# EasyEDA Pro project 最小系统板.eprj, schematic Schematic1
Board Name: Board1; Create Date: 2024-12-25; Page Name: P1; Project Name: 186改迪文屏-yan; Schematic Name: Schematic1; Update Date: 2025-02-26; Company: 嘉立创EDA; Page Size: A4; Version: V1.0
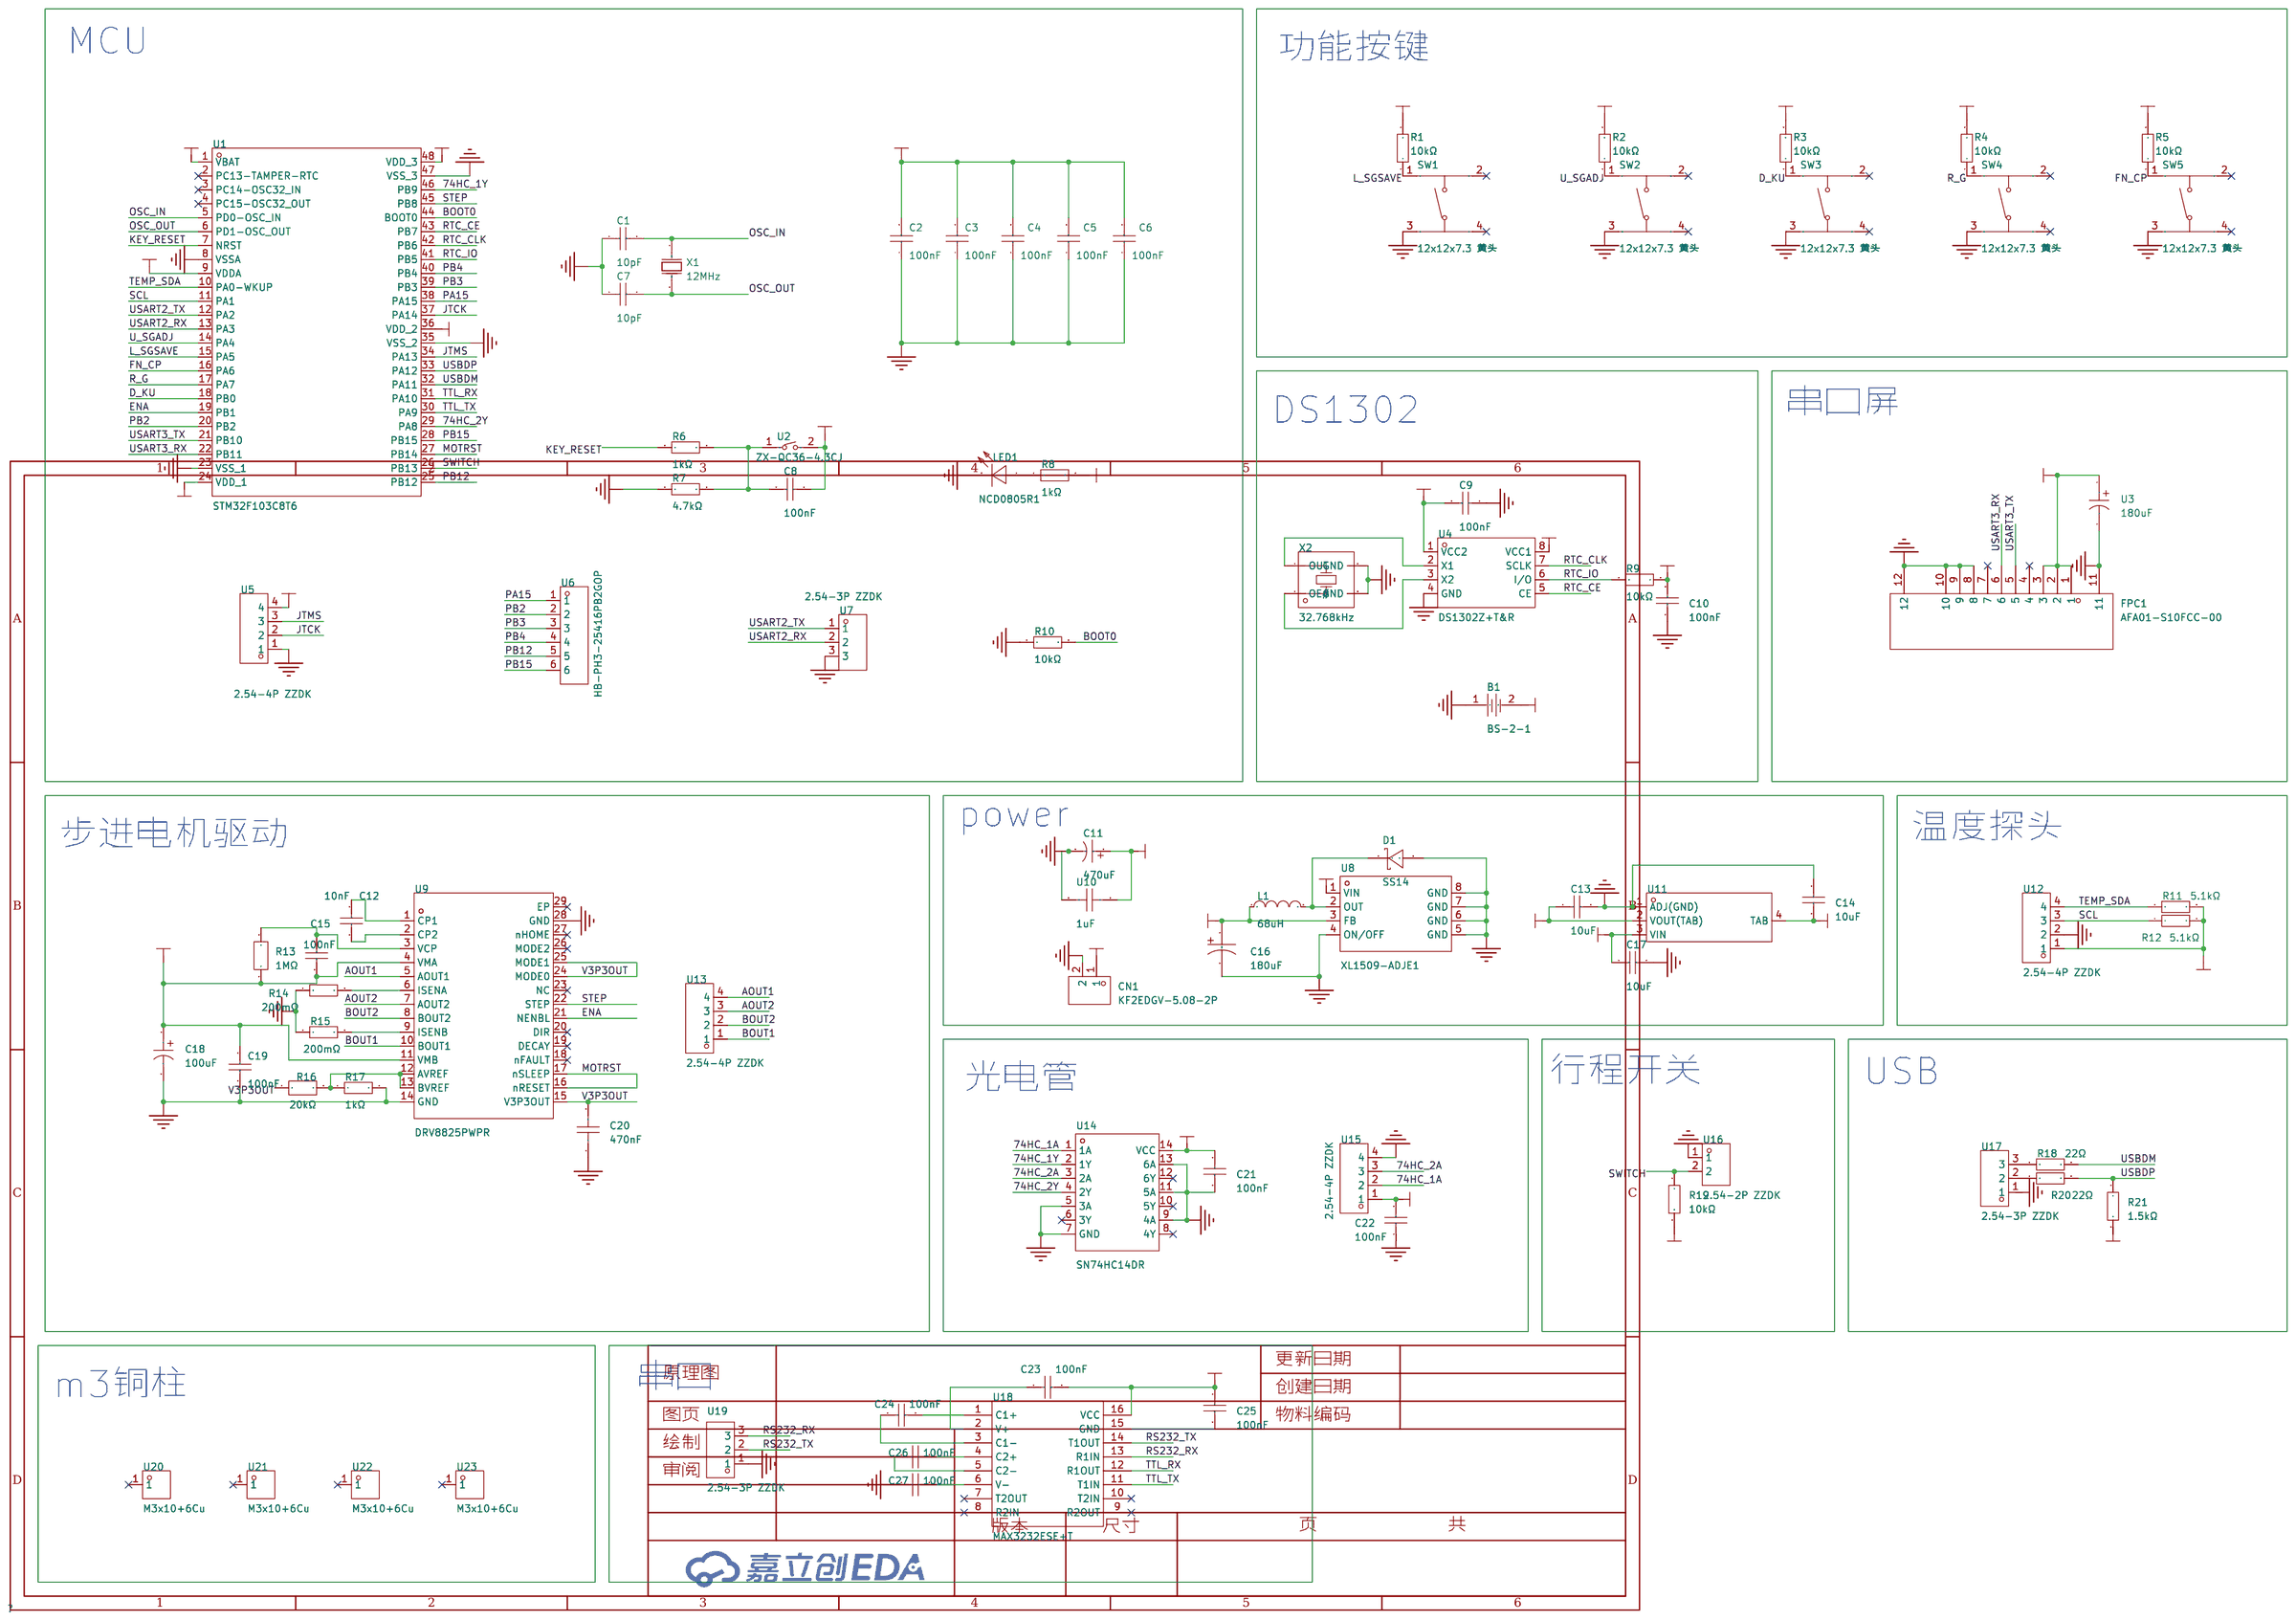
[diagram p0: schematic sheet]

## Parts
B1  BS-2-1  [BAT-TH_BS-2-1]
C1  10pF  [C0603]
C2  100nF  [C0805]
C3  100nF  [C0805]
C4  100nF  [C0805]
C5  100nF  [C0805]
C6  100nF  [C0805]
C7  10pF  [C0603]
C8  100nF  [C0805]
C9  100nF  [C0805]
C10  100nF  [C0805]
C11  470uF  [CAP-SMD_BD10.0-L10.3-W10.3-LS11.0-R-RD]
C12  10nF  [C0805]
C13  10uF  [C0805]
C14  10uF  [C0805]
C15  100nF  [C0805]
C16  180uF  [CAP-TH_BD8.0-P3.50-D0.6-FD]
C17  10uF  [C0805]
C18  100uF  [CAP-SMD_BD6.3-L6.6-W6.6-LS7.6-FD-1]
C19  100nF  [C0805]
C20  470nF  [CAP-TH_L18.0-W8.5-P15.00-D0.8]
C21  100nF  [C0805]
C22  100nF  [C0805]
C23  100nF  [C0805]
C24  100nF  [C0805]
C25  100nF  [C0805]
C26  100nF  [C0805]
C27  100nF  [C0805]
CN1  KF2EDGV-5.08-2P  [CONN-TH_P5.08_KF2EDGV-5.08-2P]
D1  SS14  [SMA_L4.2-W2.6-LS5.3-RD]
FPC1  AFA01-S10FCC-00  [FPC-SMD_AFA01-S10FCC-00]
L1  68uH  [IND-SMD_L8.0-W8.0_SMNR8040]
LED1  NCD0805R1  [LED0805-R-RD]
R1  10kΩ  [R0805]
R2  10kΩ  [R0805]
R3  10kΩ  [R0805]
R4  10kΩ  [R0805]
R5  10kΩ  [R0805]
R6  1kΩ  [R0805]
R7  4.7kΩ  [R0805]
R8  1kΩ  [R0805]
R9  10kΩ  [R0805]
R10  10kΩ  [R0805]
R11  5.1kΩ  [R0805]
R12  5.1kΩ  [R0805]
R13  1MΩ  [R0805]
R14  200mΩ  [R2512]
R15  200mΩ  [R2512]
R16  20kΩ  [R0805]
R17  1kΩ  [R0805]
R18  22Ω  [R0805]
R19  10kΩ  [R0805]
R20  22Ω  [R0805]
R21  1.5kΩ  [R0603]
SW1  12x12x7.3 黄头  [SW-TH_4P-L12.0-W12.0-P5.00-LS12.5]
SW2  12x12x7.3 黄头  [SW-TH_4P-L12.0-W12.0-P5.00-LS12.5]
SW3  12x12x7.3 黄头  [SW-TH_4P-L12.0-W12.0-P5.00-LS12.5]
SW4  12x12x7.3 黄头  [SW-TH_4P-L12.0-W12.0-P5.00-LS12.5]
SW5  12x12x7.3 黄头  [SW-TH_4P-L12.0-W12.0-P5.00-LS12.5]
U1  STM32F103C8T6  [LQFP-48_L7.0-W7.0-P0.50-LS9.0-BL]
U2  ZX-QC36-4.3CJ  [KEY-TH_L6.0-W3.5-P6.50]
U3  180uF  [CAP-SMD_BD6.3-L6.6-W6.6-LS7.3-FD]
U4  DS1302Z+T&R  [SOIC-8_L4.9-W3.9-P1.27-LS6.0-BL]
U5  2.54-4P ZZDK  [HDR-TH_4P-P2.50-V-F-2]
U6  HB-PH3-25416PB2GOP  [HDR-TH_6P-P2.54-V-M]
U7  2.54-3P ZZDK  [HDR-TH_3P-P2.50-V-F-2]
U8  XL1509-ADJE1  [SOIC-8_L5.0-W4.0-P1.27-LS6.0-BL]
U9  DRV8825PWPR  [HTSSOP-28_L9.7-W4.4-P0.65-LS6.4-BL-EP]
U10  1uF  [C1210]
U11  AMS1117-3.3  [SOT-223-4_L6.5-W3.5-P2.30-LS7.0-BR]
U12  2.54-4P ZZDK  [HDR-TH_4P-P2.50-V-F-2]
U13  2.54-4P ZZDK  [HDR-TH_4P-P2.50-V-F-2]
U14  SN74HC14DR  [SOIC-14_L8.7-W3.9-P1.27-LS6.0-BL]
U15  2.54-4P ZZDK  [HDR-TH_4P-P2.50-V-F-2]
U16  2.54-2P ZZDK  [HDR-TH_2P-P2.50-V-F-1]
U17  2.54-3P ZZDK  [HDR-TH_3P-P2.50-V-F-2]
U18  MAX3232ESE+T  [SOIC-16_L9.9-W3.9-P1.27-LS6.0-BL]
U19  2.54-3P ZZDK  [HDR-TH_3P-P2.50-V-F-2]
U20  M3x10+6Cu  [SMD_L4.7-W4.7-D3.0]
U21  M3x10+6Cu  [SMD_L4.7-W4.7-D3.0]
U22  M3x10+6Cu  [SMD_L4.7-W4.7-D3.0]
U23  M3x10+6Cu  [SMD_L4.7-W4.7-D3.0]
X1  12MHz  [OSC-SMD_L5.0-W3.2]
X2  32.768kHz  [CRYSTAL-SMD_4P-L8.0-W3.8-BL]

## Library data of the parts
B1 = BS-2-1_C70376: LCSC Part Name: 电池底座; Supplier Part: C70376; Manufacturer: Q&J; Supplier Footprint: 插件; JLCPCB Part Class: 扩展库; Datasheet: https://atta.szlcsc.com/upload/public/pdf/source/20160427/1461725216526.pdf; Supplier: LCSC; Connector Type: 电池底座; Operating Temperature Range: -55℃~+85℃
C1 C7 = CL10C100JB8NNNC: LCSC Part Name: 10pF ±5% 50V; Supplier Part: C1634; Manufacturer: SAMSUNG(三星); Supplier Footprint: 0603; JLCPCB Part Class: 基础库; Datasheet: https://atta.szlcsc.com/upload/public/pdf/source/20160218/1457707763339.pdf; Supplier: LCSC; Tolerance: ±5%; Voltage Rated: 50V; Temperature Coefficient: C0G
C2-C6 C8-C10 C15 C19 C21-C27 = CL21B104KBCNNNC: LCSC Part Name: 100nF ±10% 50V; Supplier Part: C1711; Manufacturer: SAMSUNG(三星); Supplier Footprint: 0805; JLCPCB Part Class: 扩展库; Datasheet: https://atta.szlcsc.com/upload/public/pdf/source/20160218/1457707763339.pdf; Supplier: LCSC; Tolerance: ±10%; Voltage Rated: 50V; Temperature Coefficient: X7R
C11 = RVT1V471M1010_C72519: LCSC Part Name: 470uF ±20% 35V; Supplier Part: C72519; Manufacturer: ROQANG(容强); Manufacturer Part: RVT1V471M1010; Supplier Footprint: SMD,D10xL10.2mm; JLCPCB Part Class: Extended Part; Datasheet: https://atta.szlcsc.com/upload/public/pdf/source/20210128/C72519_A1B8ED607B11AD36B70B1D23AFC8819E.pdf; Supplier: LCSC; Tolerance: ±20%; Rated Voltage: 35V; Ripple Current: 286mA@120Hz; φD: 10mm; L: 10.2mm; Lifetime @ Temp: 2000hrs@105℃; Operating Temperature: -40℃~+105℃
C12 = CL21B103KBANNNC: LCSC Part Name: 10nF ±10% 50V; Supplier Part: C1710; Manufacturer: SAMSUNG(三星); Supplier Footprint: 0805; JLCPCB Part Class: 基础库; Datasheet: https://atta.szlcsc.com/upload/public/pdf/source/20160218/1457707763339.pdf; Supplier: LCSC; Tolerance: ±10%; Voltage Rated: 50V; Temperature Coefficient: X7R
C13 C14 C17 = CL21A106KOQNNNE: LCSC Part Name: 10uF ±10% 16V; Supplier Part: C1713; Manufacturer: SAMSUNG(三星); Supplier Footprint: 0805; JLCPCB Part Class: 扩展库; Datasheet: https://atta.szlcsc.com/upload/public/pdf/source/20160218/1457707763339.pdf; Supplier: LCSC; Tolerance: ±10%; Voltage Rated: 16V; Temperature Coefficient: X5R
C16 = LKMD0901V181MF: LCSC Part Name: 180uF ±20% 35V; Supplier Part: C442870; Manufacturer: Ymin(永铭); Supplier Footprint: 插件,D8xL9mm; JLCPCB Part Class: 扩展库; Datasheet: https://atta.szlcsc.com/upload/public/pdf/source/20200220/C487520_443A40905984A455D375EE990FEAA9E8.pdf; Supplier: LCSC; Tolerance: ±20%; Rated Voltage: 35V; Ripple Current: 900mA@100kHz; Equivalent Series Resistance(ESR): 210mΩ@100kHz; Lead Spacing: 3.5mm; φD: 8mm; L: 9mm; Lifetime @ Temp: 10000hrs@105℃
C18 = RVE100UF35V67RV0072: LCSC Part Name: 100uF ±20% 35V; Supplier Part: C2836437; Manufacturer: KNSCHA(科尼盛); Supplier Footprint: SMD,D6.3xL7.7mm; JLCPCB Part Class: 扩展库; Datasheet: https://atta.szlcsc.com/upload/public/pdf/source/20220719/B52EB46F8A1558448ED03D8B4CB3C24F.pdf; Supplier: LCSC; Tolerance: ±20%; Rated Voltage: 35V; Ripple Current: 230mA@120Hz; Equivalent Series Resistance(ESR): 600mΩ@100kHz; φD: 6.3mm; L: 7.7mm; Lifetime @ Temp: 2000hrs@105℃; Operating Temperature: -55℃~+105℃
C20 = MPX474K31D4KN15800: LCSC Part Name: 470nF ±10% 275V 305V 310V 等级:X2; Supplier Part: C489083; Manufacturer: KNSCHA(科尼盛); Supplier Footprint: 插件,P=15mm; JLCPCB Part Class: 扩展库; Datasheet: https://atta.szlcsc.com/upload/public/pdf/source/20200225/C489083_F6E19227418858FC365C5FE899E9F354.pdf; Supplier: LCSC; Tolerance: ±10%; Voltage(AC): 275V；310V；305V; Subclass: X2; safety certification: UL；CUL；KC；ENEC；VDE；CQC; Operating Temperature: -40℃~+110℃
CN1 = KF2EDGV-5.08-2P: LCSC Part Name: 5.08mm 1x2P 排数:1 每排P数:2; Supplier Part: C441354; Manufacturer: KEFA(科发); Supplier Footprint: 插件,P=5.08mm; JLCPCB Part Class: 扩展库; Datasheet: https://atta.szlcsc.com/upload/public/pdf/source/20230331/07EACEF7A0E6B8900C77AF4F304A3561.pdf; Supplier: LCSC; Connector Type: 板端/插座-开口; Structure: 1x2P; Pitch: 5.08mm; Color: 绿色; Mounting Style: 直针; Number of Pins: 2P; Number of Rows: 1; Number of PINs Per Row: 2; Current Rating (Max): 15A; Voltage Rating (Max): 300V; Operating Temperature Range: -40℃~+105℃
D1 = SS14_C2480: LCSC Part Name: 电压:40V 电流:1A; Supplier Part: C2480; Manufacturer: MDD(辰达半导体); Supplier Footprint: SMA(DO-214AC); JLCPCB Part Class: 基础库; Datasheet: https://atta.szlcsc.com/upload/public/pdf/source/20240710/EF24798823EE33D63F154ED67BAC5E71.pdf; Supplier: LCSC; Diode Configuration: 独立式; Forward Voltage (Vf@If): 550mV@1A; Reverse Voltage (Vr): 40V; Rectified Current: 1A; Reverse Leakage Current (Ir): 300uA@40V
FPC1 = AFA01-S10FCC-00: LCSC Part Name: 间距:1mm P数:10P 翻盖式 下接; Supplier Part: C262385; Manufacturer: JS(钜硕电子); Supplier Footprint: SMD,P=1mm,卧贴; JLCPCB Part Class: 扩展库; Datasheet: https://atta.szlcsc.com/upload/public/pdf/source/20180820/C262762_EBECD0847A529CA64FD00527F6604CA9.pdf; Supplier: LCSC; Locking Feature: 翻盖式; Contact Type: 下接; Number of Contacts: 10P; Pitch: 1mm; Mounting Type: 卧贴; FFC, FCB Thickness: 0.3mm; Height Above Board: 2mm
L1 = SWPA8040S680MT: LCSC Part Name: 68uH ±20% 1.45A; Supplier Part: C36418; Manufacturer: Sunlord(顺络); Supplier Footprint: SMD; JLCPCB Part Class: 扩展库; Datasheet: https://atta.szlcsc.com/upload/public/pdf/source/20231024/317626D2AA2F8AB4113C1875E432E6E1.pdf; Supplier: LCSC; Tolerance: ±20%; Rated Current: 1.25A; Saturation Current (Isat): 1.45A; DC Resistance (DCR): 255mΩ
LED1 = NCD0805R1: Supplier Part: C84256; Manufacturer: 国星光电; Supplier Footprint: 0805; JLCPCB Part Class: 基础库; Datasheet: https://atta.szlcsc.com/upload/public/pdf/source/20200820/C84256_F0A75A43B3EAD75808600A0514C76B99.pdf; Supplier: LCSC; Emitted Color: 红色; Forward Voltage (VF): 1.6V~2.6V; Power Dissipation: 65mW; Forward Current: 20mA; Dominant Wavelength: 615nm~630nm; Diode Configuration: 独立二极管; Lens Color: 无色透明透镜; Luminous Intensity: 67mcd~195mcd; Viewing Angle: 130°; Operating Temperature: -30℃~+85℃
R1-R5 R9 R10 R19 = 0805W8F1002T5E_C17414: LCSC Part Name: 10kΩ ±1% 125mW 厚膜电阻; Supplier Part: C17414; Manufacturer: UNI-ROYAL(厚声); Manufacturer Part: 0805W8F1002T5E; Supplier Footprint: 0805; JLCPCB Part Class: 基础库; Datasheet: https://atta.szlcsc.com/upload/public/pdf/source/20200306/C422600_1E6D84923E4A46A82E41ADD87F860B5C.pdf; Supplier: LCSC; Type: 厚膜电阻; Tolerance: ±1%; Power(Watts): 125mW; Overload Voltage (Max): 150V; Temperature Coefficient: ±100ppm/℃; Operating Temperature Range: -55℃~+155℃
R6 R8 R17 = 0805W8F1001T5E: LCSC Part Name: 1kΩ ±1% 125mW 厚膜电阻; Supplier Part: C17513; Manufacturer: UNI-ROYAL(厚声); Supplier Footprint: 0805; JLCPCB Part Class: 基础库; Datasheet: https://atta.szlcsc.com/upload/public/pdf/source/20200306/C422600_1E6D84923E4A46A82E41ADD87F860B5C.pdf; Supplier: LCSC; Type: 厚膜电阻; Tolerance: ±1%; Power(Watts): 125mW; Overload Voltage (Max): 150V; Temperature Coefficient: ±100ppm/℃; Operating Temperature Range: -55℃~+155℃
R7 = 0805W8F4701T5E: LCSC Part Name: 4.7kΩ ±1% 125mW 厚膜电阻; Supplier Part: C17673; Manufacturer: UNI-ROYAL(厚声); Supplier Footprint: 0805; JLCPCB Part Class: 基础库; Datasheet: https://atta.szlcsc.com/upload/public/pdf/source/20200306/C422600_1E6D84923E4A46A82E41ADD87F860B5C.pdf; Supplier: LCSC; Type: 厚膜电阻; Tolerance: ±1%; Power(Watts): 125mW; Overload Voltage (Max): 150V; Temperature Coefficient: ±100ppm/℃; Operating Temperature Range: -55℃~+155℃
R11 R12 = 0805W8F5101T5E: LCSC Part Name: 5.1kΩ ±1% 125mW 厚膜电阻; Supplier Part: C27834; Manufacturer: UNI-ROYAL(厚声); Supplier Footprint: 0805; JLCPCB Part Class: 基础库; Datasheet: https://atta.szlcsc.com/upload/public/pdf/source/20200306/C422600_1E6D84923E4A46A82E41ADD87F860B5C.pdf; Supplier: LCSC; Type: 厚膜电阻; Tolerance: ±1%; Power(Watts): 125mW; Overload Voltage (Max): 150V; Temperature Coefficient: ±100ppm/℃; Operating Temperature Range: -55℃~+155℃
R13 = SC0805F1004F4ANRH: LCSC Part Name: 1MΩ ±1%; Supplier Part: C3152182; Manufacturer: Sunway(信维通信); Supplier Footprint: 0805; JLCPCB Part Class: 扩展库; Datasheet: https://atta.szlcsc.com/upload/public/pdf/source/20220728/FFCE43BB6DF8FA16AEE331F0F4B289DE.pdf; Supplier: LCSC; Tolerance: ±1%; Temperature Coefficient: ±100ppm/℃
R14 R15 = 25121WF200LT4E: LCSC Part Name: 200mΩ ±1% 1W 厚膜电阻; Supplier Part: C83749; Manufacturer: UNI-ROYAL(厚声); Supplier Footprint: 2512; JLCPCB Part Class: 扩展库; Datasheet: https://atta.szlcsc.com/upload/public/pdf/source/20200306/C422600_1E6D84923E4A46A82E41ADD87F860B5C.pdf; Supplier: LCSC; Type: 厚膜电阻; Tolerance: ±1%; Power(Watts): 1W; Overload Voltage (Max): 200V; Temperature Coefficient: ±800ppm/℃; Operating Temperature Range: -55℃~+155℃
R16 = FRC0805F2002TS: LCSC Part Name: 20kΩ ±1% 125mW 厚膜电阻; Supplier Part: C2907240; Manufacturer: FOJAN(富捷); Supplier Footprint: 0805; JLCPCB Part Class: 扩展库; Datasheet: https://atta.szlcsc.com/upload/public/pdf/source/20211221/925EC7D7225764EE0046F22065062C87.pdf; Supplier: LCSC; Type: 厚膜电阻; Tolerance: ±1%; Power(Watts): 125mW; Overload Voltage (Max): 150V; Temperature Coefficient: ±100ppm/℃; Operating Temperature Range: -55℃~+155℃
R18 R20 = 0805W8F220JT5E: LCSC Part Name: 22Ω ±1% 125mW 厚膜电阻; Supplier Part: C17561; Manufacturer: UNI-ROYAL(厚声); Supplier Footprint: 0805; JLCPCB Part Class: 基础库; Datasheet: https://atta.szlcsc.com/upload/public/pdf/source/20200306/C422600_1E6D84923E4A46A82E41ADD87F860B5C.pdf; Supplier: LCSC; Type: 厚膜电阻; Tolerance: ±1%; Power(Watts): 125mW; Overload Voltage (Max): 150V; Temperature Coefficient: ±100ppm/℃; Operating Temperature Range: -55℃~+155℃
R21 = 0603WAF1501T5E: LCSC Part Name: 1.5kΩ ±1% 100mW 厚膜电阻; Supplier Part: C22843; Manufacturer: UNI-ROYAL(厚声); Supplier Footprint: 0603; JLCPCB Part Class: 基础库; Datasheet: https://atta.szlcsc.com/upload/public/pdf/source/20200306/C422600_1E6D84923E4A46A82E41ADD87F860B5C.pdf; Supplier: LCSC; Type: 厚膜电阻; Tolerance: ±1%; Power(Watts): 100mW; Overload Voltage (Max): 75V; Temperature Coefficient: ±100ppm/℃; Operating Temperature Range: -55℃~+155℃
SW1-SW5 = 12x12x7.3 黄头: LCSC Part Name: 12*12*7.3mm 直插 轻触开关; Supplier Part: C10861; Manufacturer: BOOMELE(博穆精密); Supplier Footprint: 插件; JLCPCB Part Class: 扩展库; Datasheet: https://atta.szlcsc.com/upload/public/pdf/source/20150923/1457707411069.pdf; Supplier: LCSC; Circuit: 单刀单掷; Actuator Style: 矩形按钮; Mounting Style: 直插; Switch Length: 12mm; Switch Width: 12mm; Switch Height: 7.3mm; Contact Current: 50mA; Voltage Rating (DC): 12V
U1 = STM32F103C8T6: LCSC Part Name: 主流增强型ARM Cortex-M3 MCU，具有64 KB Flash、72 MHz CPU、电机控制、USB和CAN; Supplier Part: C8734; Manufacturer: ST(意法半导体); Supplier Footprint: LQFP-48(7x7); JLCPCB Part Class: 扩展库; Datasheet: https://atta.szlcsc.com/upload/public/pdf/source/20220812/8363ACEC51AD55ECEB84799464F7CB85.pdf; Supplier: LCSC; CPU Core: ARM-M3; CPU Maximum Speed: 72MHz; Program Storage Size: 64KB; Program Memory Type: FLASH; GPIO Ports Number: 37; ADC (Bit): 12bit; Low Voltage Detection Threshold: 2V~3.6V
U2 = ZX-QC36-4.3CJ: LCSC Part Name: 3*6*4.3插件开关; Supplier Part: C7470223; Manufacturer: Megastar(兆星); Supplier Footprint: DIP; JLCPCB Part Class: 扩展库; Datasheet: https://atta.szlcsc.com/upload/public/pdf/source/20230724/E786959C53B2405F67FB2C8E5CC6989E.pdf; Supplier: LCSC; Circuit: 单刀单掷; Actuator Style: 矩形按钮; Operating Force: 260gf; Mounting Style: 直插; Switch Length: 3mm; Switch Width: 6mm; Switch Height: 4.3mm; Strike Gundam: 不带; Contact Current: 50mA; Voltage Rating (AC): 250V; Voltage Rating (DC): 12V; Insulation Resistance: 100MΩ; Actuator/Cap Color: 白色; Pin Style: PC引脚; Mechanical Life: 10万次; Operating Temperature: -30℃~+80℃
U3 = KNM2180UF16V118EC0094: LCSC Part Name: 180uF ±20% 16V; Supplier Part: C2943990; Manufacturer: KNSCHA(科尼盛); Supplier Footprint: SMD,D6.3xL6.5mm; JLCPCB Part Class: 扩展库; Datasheet: https://atta.szlcsc.com/upload/public/pdf/source/20220426/2498E51E5C1E4E393AA07C1BCCDA9F22.pdf; Supplier: LCSC; Tolerance: ±20%; Rated Voltage: 16V; Ripple Current: 3.3A@100kHz; Equivalent Series Resistance(ESR): 22mΩ@100kHz; Lead Spacing: 2.5mm; φD: 6.3mm; L: 6.5mm; Lifetime @ Temp: 2000hrs@105℃; Operating Temperature: -55℃~+105℃
U4 = DS1302Z+T&R: LCSC Part Name: 带涓流充电的时钟芯片; Supplier Part: C8959; Manufacturer: ADI(亚德诺)/MAXIM(美信); Supplier Footprint: SOIC-8; JLCPCB Part Class: 扩展库; Datasheet: https://atta.szlcsc.com/upload/public/pdf/source/20130705/1457706621880.pdf; Supplier: LCSC; Interface: SPI; Operating Voltage: 2V~5.5V; Operating Temperature: 0℃~+70℃
U5 U12 U13 U15 = 2.54-4P ZZDK: LCSC Part Name: 1x4P 间距:2.5mm 直插 系列:XH 白色; Supplier Part: C18185651; Manufacturer: SHOU HAN(首韩); Supplier Footprint: 插件,P=2.5mm; JLCPCB Part Class: 扩展库; Datasheet: https://atta.szlcsc.com/upload/public/pdf/source/20240805/DA6CED37D07A6650CC69583645F2A0D6.pdf; Supplier: LCSC; Pins Structure: 1x4P; Pitch: 2.5mm; Mounting Style: 直插; Reference Series: XH; Number of Pins: 4P; Number of Rows: 1; Number of PINs Per Row: 4; Current Rating (Max): 3A; Contact Material: 黄铜; Contact Plating: 锡; Operating Temperature Range: -25℃~+85℃
U6 = HB-PH3-25416PB2GOP: LCSC Part Name: 间距:2.54mm 1x6P 直插 方针; Supplier Part: C6332199; Manufacturer: HANBO(汉博); Supplier Footprint: 插件,P=2.54mm; JLCPCB Part Class: 扩展库; Datasheet: https://atta.szlcsc.com/upload/public/pdf/source/20230803/F72D259687963761DF1B552F3BB84A31.pdf; Supplier: LCSC; Pin Structure: 1x6P; Pitch: 2.54mm; Row Spacing: 2.54mm; Circluar Pins/Square Pins: 方针; Mounting Type: 直插; Number of Rows: 单排; Number of Pins: 6P; Current Rating (Max): 3A; Voltage Rating (Max): 250V; Length of Mating Pin: 6mm; Insulation Height: 2.54mm; Length of End Connection Pin: 3mm; Contact Material: 黄铜; Contact Plating: 金; Operating Temperature Range: -40℃~+105℃; Soldering Temperature(Max): 260℃; Color: 黑色
U7 U17 U19 = 2.54-3P ZZDK: LCSC Part Name: 1x3P 间距:2.5mm 直插 系列:XH 白色; Supplier Part: C18185650; Manufacturer: SHOU HAN(首韩); Supplier Footprint: 插件,P=2.5mm; JLCPCB Part Class: 扩展库; Datasheet: https://atta.szlcsc.com/upload/public/pdf/source/20240805/F522CDFA12287D422D641D046158ACCD.pdf; Supplier: LCSC; Pins Structure: 1x3P; Pitch: 2.5mm; Mounting Style: 直插; Reference Series: XH; Number of Pins: 3P; Number of Rows: 1; Number of PINs Per Row: 3; Current Rating (Max): 3A; Contact Material: 黄铜; Contact Plating: 锡; Operating Temperature Range: -25℃~+85℃
U8 = XL1509-ADJE1: Supplier Part: C74192; Manufacturer: XLSEMI(芯龙); Supplier Footprint: SOIC-8; JLCPCB Part Class: 扩展库; Datasheet: https://atta.szlcsc.com/upload/public/pdf/source/20160525/1464169836595.pdf; Supplier: LCSC; Function: 降压型; Switch tube (built-in/external): 内置
U9 = DRV8825PWPR: LCSC Part Name: 2.5A 45V电机驱动芯片; Supplier Part: C81582; Manufacturer: TI(德州仪器); Supplier Footprint: HTSSOP-28-EP; JLCPCB Part Class: 扩展库; Datasheet: https://www.ti.com/cn/lit/gpn/drv8825; Supplier: LCSC
U10 = ECPU1C105MA5: LCSC Part Name: 1uF ±20% 12V 16V; Supplier Part: C569895; Manufacturer: PANASONIC(松下); Supplier Footprint: 1210; JLCPCB Part Class: 扩展库; Datasheet: https://atta.szlcsc.com/upload/public/pdf/source/20220301/D3752930929FB45F0A189FC722D00762.pdf; Supplier: LCSC; Tolerance: ±20%; Voltage Rated: 16V；12V; Dielectric Material: 丙烯酸; Operating Temperature: -40℃~+85℃
U11 = AMS1117-3.3_C347222: LCSC Part Name: 输出:3.3V 电流:1A 耐压:12V; Supplier Part: C347222; Manufacturer: UMW(友台半导体); Supplier Footprint: SOT-223; JLCPCB Part Class: 扩展库; Datasheet: https://atta.szlcsc.com/upload/public/pdf/source/20241218/BAF0263FA2E44BCD8AF41AA4FA04EFAA.pdf; Supplier: LCSC; Output Type: 固定; Maximum Input Voltage: 12V; Output Voltage: 3.3V; Output Current: 1A; Power Supply Rejection Ratio (PSRR): 60dB@(120Hz); Dropout Voltage: 1.3V@(1A); Feature: 过流保护(OCP); Output Polarity: 正极; Number of Outputs: 1
U14 = SN74HC14DR: LCSC Part Name: 六路施密特触发反相器; Supplier Part: C6820; Manufacturer: TI(德州仪器); Supplier Footprint: SOIC-14; JLCPCB Part Class: 扩展库; Datasheet: https://www.ti.com/cn/lit/gpn/sn74hc14; Supplier: LCSC; Input Type: 施密特触发器; Supply Voltage(Single): 2V~6V; Supply Current (Max): 2uA; Number of Circuits: 6; Number of Inputs: 1; Sink Current: 5.2mA; Source Current: 5.2mA; High level range (VIH): 1.5V~4.2V; Low level range (VIL): 300mV~1.2V; Max Propagation Delay: 21ns@6V,50pF; Series: 74HC系列; Operating Temperature: -40℃~+85℃
U16 = 2.54-2P ZZDK: LCSC Part Name: 1x2P 间距:2.5mm 直插 系列:XH 白色; Supplier Part: C18185649; Manufacturer: SHOU HAN(首韩); Supplier Footprint: 插件,P=2.5mm; JLCPCB Part Class: 扩展库; Datasheet: https://atta.szlcsc.com/upload/public/pdf/source/20240805/B8575AAB65120F9BBF46D4AF9A703A1F.pdf; Supplier: LCSC; Pins Structure: 1x2P; Pitch: 2.5mm; Mounting Style: 直插; Reference Series: XH; Number of Pins: 2P; Number of Rows: 1; Number of PINs Per Row: 2; Current Rating (Max): 3A; Contact Material: 黄铜; Contact Plating: 锡; Operating Temperature Range: -25℃~+85℃
U18 = MAX3232ESE+T: LCSC Part Name: 3.0V至5.5V，低功耗，高达1Mbps，真正的RS-232收发器; Supplier Part: C15846; Manufacturer: ADI(亚德诺)/MAXIM(美信); Supplier Footprint: SOIC-16; JLCPCB Part Class: 扩展库; Datasheet: https://atta.szlcsc.com/upload/public/pdf/source/20220812/1D5DF2FF91750DFE63BD771071C0B1F6.pdf; Supplier: LCSC; Types: 收发器; Number of Driver: 2; Number of receiver: 2; Data Rate: 250Kbps; Supply Voltage: 3V~5.5V; Operating Temperature: -40℃~+85℃
U20-U23 = M3x10+6Cu: LCSC Part Name: Shuntian(顺天五金)空心六角隔离铜柱PCBA隔离铜柱M3x10+6Cu国标 黄铜 本色 袋装; Supplier Part: C551322; Manufacturer: Shuntian(顺天五金); JLCPCB Part Class: 扩展库; Datasheet: https://atta.szlcsc.com/upload/public/pdf/source/20200518/C357406_C09EF4431115B36F205D341EAA7D5F43.pdf; Supplier: LCSC; material quality: 黄铜; standard: 国标; Specifications: M3X16; surface treatment: 本色; structure type: 单头; Shape Type: 六角; purpose: 隔离; type: 螺柱; Total length: 16mm; diameter: 3mm; Thread length: 6mm; hexagonal opposite edge: 4.7mm
X1 = XSHEELNANF-12MHZ: LCSC Part Name: 12MHz ±30ppm 20pF; Supplier Part: C295065; Manufacturer: TAITIEN(泰艺电子); Supplier Footprint: SMD5032; JLCPCB Part Class: 扩展库; Datasheet: https://atta.szlcsc.com/upload/public/pdf/source/20181022/C295065_30495E01EBF1E615C4AE562CEB2D9337.pdf; Supplier: LCSC; Crystal Type: 贴片晶振; Normal temperature Frequency Tolerance: ±30ppm; External load capacitor: 20pF; Frequency Stability(Full temperature range): ±30ppm; Operating Temperature: -40℃~+85℃
X2 = ABS25-32.768KHZ-T: LCSC Part Name: 32.768kHz ±20ppm 12.5pF; Supplier Part: C179637; Manufacturer: ABRACON; Supplier Footprint: MC-306; JLCPCB Part Class: 扩展库; Datasheet: https://atta.szlcsc.com/upload/public/pdf/source/20180207/C179637_15179896523281356363.pdf; Supplier: LCSC; Normal temperature Frequency Tolerance: ±20ppm; External load capacitor: 12.5pF; Equivalent Series Resistance (ESR): 50kΩ; Operating Temperature: -40℃~+85℃

## Nets
3.3V: C2.2 C3.2 C4.2 C5.2 C6.2 C8.1 C9.2 C10.1 C13.1 C14.2 C21.1 C22.2 C23.2 C25.1 R1.2 R2.2 R3.2 R4.2 R5.2 R8.2 R9.2 R11.2 R12.2 R19.2 R21.2 U1.1(VBAT) U1.9(VDDA) U1.24(VDD_1) U1.36(VDD_2) U1.48(VDD_3) U2.2 U4.1(VCC2) U5.4 U11.2(VOUT(TAB)) U11.4(TAB) U12.1 U14.14(VCC) U15.1 U18.16(VCC)
5V: C16.1 C17.1 FPC1.1 FPC1.2 FPC1.3 L1.1 U3.1 U8.3(FB) U11.3(VIN)
12V: C11.1 C15.2 C18.1 C19.2 CN1.1 R13.1 U8.1(VIN) U9.4(VMA) U9.11(VMB) U10.2
GND: B1.1 C1.1 C2.1 C3.1 C4.1 C5.1 C6.1 C7.1 C9.1 C10.2 C11.2 C13.2 C14.1 C16.2 C17.2 C18.2 C19.1 C20.1 C21.2 C22.1 C27.1 CN1.2 D1.2(A) FPC1.8 FPC1.9 FPC1.10 FPC1.11 FPC1.12 LED1.2(-) R7.1 R10.1 R14.1 R15.1 R17.2 SW1.3 SW2.3 SW3.3 SW4.3 SW5.3 U1.8(VSSA) U1.23(VSS_1) U1.35(VSS_2) U1.47(VSS_3) U3.2 U4.4(GND) U5.1 U7.3 U8.4(ON/OFF) U8.5(GND) U8.6(GND) U8.7(GND) U8.8(GND) U9.14(GND) U9.28(GND) U10.1 U11.1(ADJ(GND)) U12.2 U14.5(3A) U14.7(GND) U14.9(4A) U14.11(5A) U14.13(6A) U15.4 U16.1 U17.1 U19.1 X2.2(GND) X2.3(GND)
V3P3OUT: C20.2 R16.1 U9.15(V3P3OUT) U9.24(MODE0) U9.25(MODE1)
74HC_1A: U14.1(1A) U15.2
74HC_1Y: U1.46(PB9) U14.2(1Y)
74HC_2A: U14.3(2A) U15.3
74HC_2Y: U1.29(PA8) U14.4(2Y)
AOUT1: U9.5(AOUT1) U13.4
AOUT2: U9.7(AOUT2) U13.3
BATA+: B1.2 U4.8(VCC1)
BOOT0: R10.2 U1.44(BOOT0)
BOUT1: U9.10(BOUT1) U13.1
BOUT2: U9.8(BOUT2) U13.2
D_KU: R3.1 SW3.1 U1.18(PB0)
ENA: U1.19(PB1) U9.21(NENBL)
FN_CP: R5.1 SW5.1 U1.16(PA6)
JTCK: U1.37(PA14) U5.2
JTMS: U1.34(PA13) U5.3
KEY_RESET: R6.1 U1.7(NRST)
L_SGSAVE: R1.1 SW1.1 U1.15(PA5)
MOTRST: U1.27(PB14) U9.16(nRESET) U9.17(nSLEEP)
OSC_IN: C1.2 U1.5(PD0-OSC_IN) X1.1(OSC1)
OSC_OUT: C7.2 U1.6(PD1-OSC_OUT) X1.2(OSC2)
PA15: U1.38(PA15) U6.1
PB2: U1.20(PB2) U6.2
PB3: U1.39(PB3) U6.3
PB4: U1.40(PB4) U6.4
PB12: U1.25(PB12) U6.5
PB15: U1.28(PB15) U6.6
R_G: R4.1 SW4.1 U1.17(PA7)
RS232_RX: U18.13(R1IN) U19.3
RS232_TX: U18.14(T1OUT) U19.2
RTC_CE: U1.43(PB7) U4.5(CE)
RTC_CLK: U1.42(PB6) U4.7(SCLK)
RTC_IO: R9.1 U1.41(PB5) U4.6(I/O)
SCL: R12.1 U1.11(PA1) U12.3
STEP: U1.45(PB8) U9.22(STEP)
SWITCH: R19.1 U1.26(PB13) U16.2
TEMP_SDA: R11.1 U1.10(PA0-WKUP) U12.4
TTL_RX: U1.31(PA10) U18.12(R1OUT)
TTL_TX: U1.30(PA9) U18.11(T1IN)
U_SGADJ: R2.1 SW2.1 U1.14(PA4)
USART2_RX: U1.13(PA3) U7.2
USART2_TX: U1.12(PA2) U7.1
USART3_RX: FPC1.6 U1.22(PB11)
USART3_TX: FPC1.5 U1.21(PB10)
USBDM: R18.2 U1.32(PA11)
USBDP: R20.2 R21.1 U1.33(PA12)
$1N1272: C8.2 R6.2 R7.2 U2.1
$1N3398: D1.1(K) L1.2 U8.2(OUT)
$1N5455: U4.2(X1) X2.4(OUT)
$1N5465: U4.3(X2) X2.1(OE#)
$1N7385: C12.2 U9.1(CP1)
$1N7391: C12.1 U9.2(CP2)
$1N7401: C15.1 R13.2 U9.3(VCP)
$1N7525: R14.2 U9.6(ISENA)
$1N7564: R15.2 U9.9(ISENB)
$1N7781: R16.2 R17.1 U9.12(AVREF) U9.13(BVREF)
$1N8903: R18.1 U17.3
$1N8908: R20.1 U17.2
$1N9681: C25.2 U18.15(GND)
$1N9762: C23.1 U18.2(V+)
$1N9803: C24.2 U18.1(C1+)
$1N9807: C24.1 U18.3(C1-)
$1N9881: C26.2 U18.4(C2+)
$1N9885: C26.1 U18.5(C2-)
$1N9891: C27.2 U18.6(V-)
$1N11608: LED1.1(+) R8.1

Not connected (* = marked no-connect by the designer): FPC1 4* 7*; SW1 2* 4*; SW2 2* 4*; SW3 2* 4*; SW4 2* 4*; SW5 2* 4*; U1 2(PC13-TAMPER-RTC)* 3(PC14-OSC32_IN)* 4(PC15-OSC32_OUT)*; U9 18(nFAULT)* 19(DECAY)* 20(DIR)* 23(NC)* 26(MODE2)* 27(nHOME)* 29(EP)*; U14 6(3Y)* 8(4Y)* 10(5Y)* 12(6Y)*; U18 7(T2OUT)* 8(R2IN)* 9(R2OUT)* 10(T2IN)*; U20 1*; U21 1*; U22 1*; U23 1*

## Notes on the sheet
- MCU
- 功能按键
- DS1302
- 串口屏
- power
- 步进电机驱动
- 温度探头
- 光电管
- 行程开关
- USB
- 串口
- m3铜柱
